# EAGLE design Arduino Uno Satyajeet (EAGLE 9.6.2)
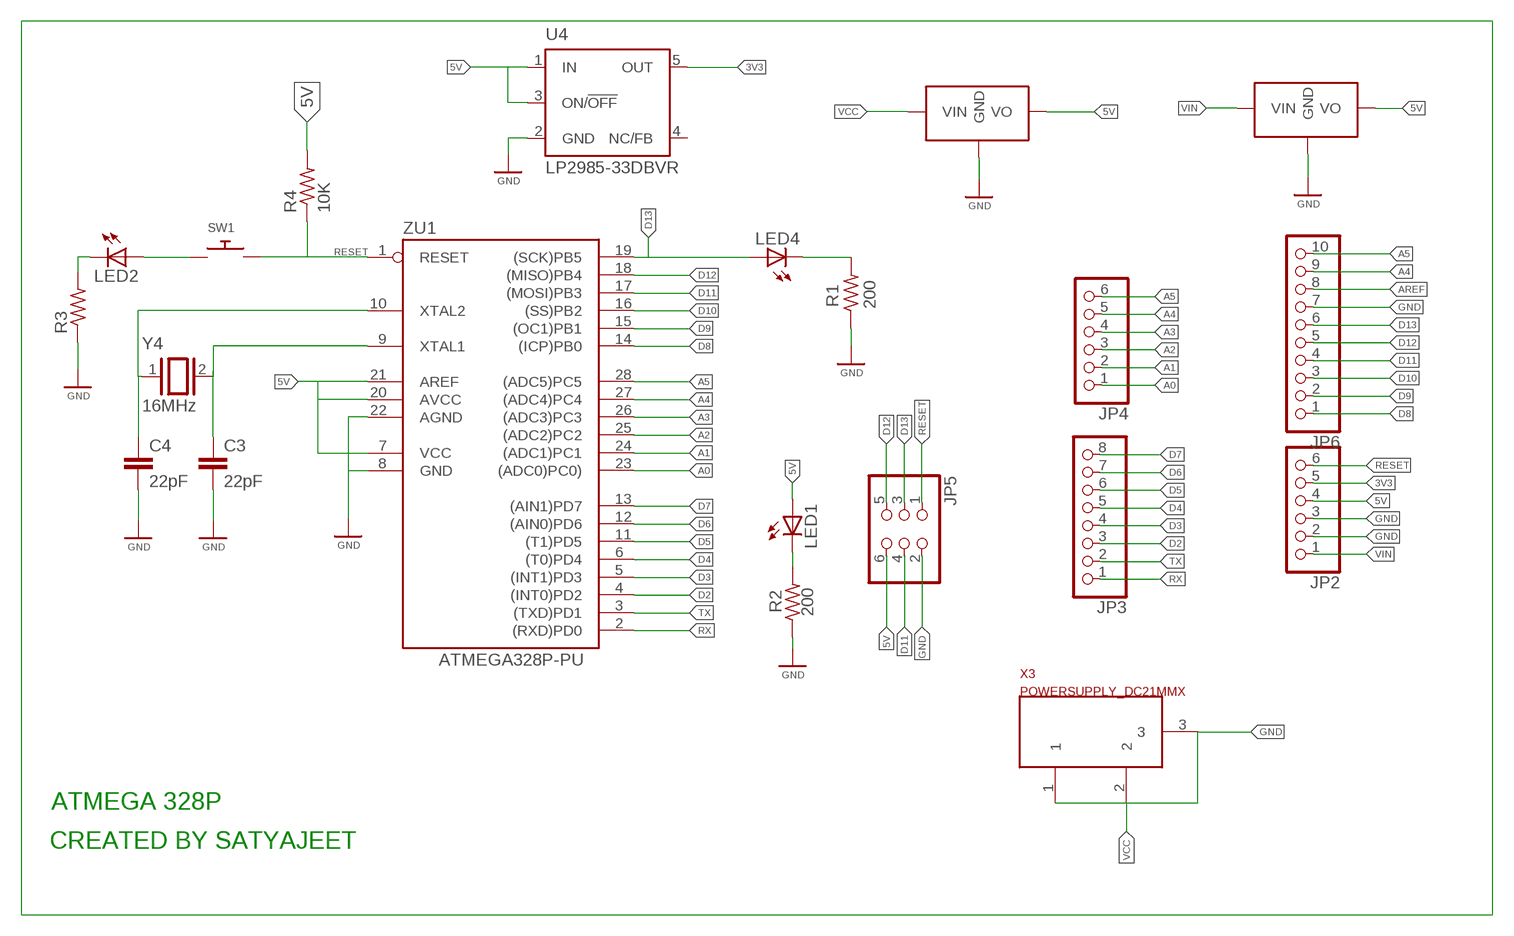
[diagram p0: schematic, sheet 1]

## Parts
C3  22pF  C2.5/2  [C2.5-2]
C4  22pF  C2.5/2  [C2.5-2]
JP2  PINHD-1X6  [1X06]
JP3  PINHD-1X8  [1X08]
JP4  PINHD-1X6  [1X06]
JP5  PINHD-2X3  [2X03]
JP6  PINHD-1X10  [1X10]
LED1  LED5MM  [LED5MM]
LED2  LED5MM  [LED5MM]
LED4  LED5MM  [LED5MM]
R1  200  R-US_0204/5  [0204/5]
R2  200  R-US_0204/5  [0204/5]
R3  R-US_0204/5  [0204/5]
R4  10K  R-US_0204/5  [0204/5]
SW1  SWITCH_PUSHBUTTONEVQ-PE  [TACT_PANA-EVQ]
U4  LP2985-33DBVR  LP2985-XXDBVR33  [SOT23-DBV]
U$1  AB_7805_FLAT  [AB_7805_FLAT]
U$2  AB_7805_FLAT  [AB_7805_FLAT]
X3  POWERSUPPLY_DC21MMX  [POWERSUPPLY_DC-21MM]
Y4  16MHz  XTAL/S  [QS]
ZU1  ATMEGA328P-PU  [DIL28-3]

## Nets
3V3: JP2.5 U4.5(OUT)
5V: JP2.4 JP5.6 LED1.A R4.2 U4.1(IN) U$1.3(VO) U$2.3(VO) ZU1.21(AREF)
A0 [data]: JP4.1 ZU1.23((ADC0)PC0))
A1 [data]: JP4.2 ZU1.24((ADC1)PC1)
A2 [data]: JP4.3 ZU1.25((ADC2)PC2)
A3 [data]: JP4.4 ZU1.26((ADC3)PC3)
A4 [data]: JP4.5 JP6.9 ZU1.27((ADC4)PC4)
A5 [data]: JP4.6 JP6.10 ZU1.28((ADC5)PC5)
AREF: JP6.8
D2 [data]: JP3.3 ZU1.4((INT0)PD2)
D3 [data]: JP3.4 ZU1.5((INT1)PD3)
D4 [data]: JP3.5 ZU1.6((T0)PD4)
D5 [data]: JP3.6 ZU1.11((T1)PD5)
D6 [data]: JP3.7 ZU1.12((AIN0)PD6)
D7 [data]: JP3.8 ZU1.13((AIN1)PD7)
D8 [data]: JP6.1 ZU1.14((ICP)PB0)
D9 [data]: JP6.2 ZU1.15((OC1)PB1)
D10 [data]: JP6.3 ZU1.16((SS)PB2)
D11 [data]: JP5.4 JP6.4 ZU1.17((MOSI)PB3)
D12 [data]: JP5.5 JP6.5 ZU1.18((MISO)PB4)
D13 [data]: JP5.3 JP6.6 LED4.A ZU1.19((SCK)PB5)
GND: C3.2 C4.2 JP2.2 JP2.3 JP5.2 JP6.7 R1.1 R2.1 R3.1 U4.2(GND) U$1.2(GND) U$2.2(GND) X3.1 X3.3 ZU1.22(AGND)
N$1: U4.3(ON/!OFF)
N$2 [data]: R4.1
N$3 [data]: C3.1 Y4.2 ZU1.9(XTAL1)
N$4 [data]: C4.1 Y4.1 ZU1.10(XTAL2)
N$5 [data]: ZU1.8(GND)
N$6 [data]: LED2.A SW1.P$1
N$7 [data]: LED2.K(C) R3.2
N$8 [data]: ZU1.7(VCC)
N$9 [data]: ZU1.20(AVCC)
N$11 [data]: LED4.K(C) R1.2
N$12: LED1.K(C) R2.2
RESET [data]: JP2.6 JP5.1 SW1.P$2 ZU1.1(RESET)
RX [data]: JP3.1 ZU1.2((RXD)PD0)
TX [data]: JP3.2 ZU1.3((TXD)PD1)
VCC: U$1.1(VIN) X3.2
VIN: JP2.1 U$2.1(VIN)
Unconnected: U4.4(NC/FB)

## Notes on the sheet
- ATMEGA 328P
- CREATED BY SATYAJEET

## Library data of the parts
C3 C4 = capacitor-wima:C: CAPACITOR naming: grid - package width
JP2 JP4 = pinhead:PINHD-1X6: PIN HEADER
JP3 = pinhead:PINHD-1X8: PIN HEADER
JP5 = pinhead:PINHD-2X3: PIN HEADER
JP6 = pinhead:PINHD-1X10: PIN HEADER
LED1 LED2 LED4 = adafruit:LED: LED OSRAM: - CHIPLED LG R971, LG N971, LY N971, LG Q971, LY Q971, LO R971, LY R971 LH N974, LH R974 LS Q976, LO Q976, LY Q976 LO Q996 - Hyper CHIPLED LW Q18S LB Q993, LB Q99A, LB R99A - SideLED LS A670, LO A670, LY A670, LG A670, LP A670 LB A673, LV A673, LT A673, LW A673 LH A674 LY A675 LS A676, LA A676, LO A676, LY A676, LW A676 LS A679, LY A679, LG A679 - Hyper Micro SIDELED® LS Y876, LA Y876, LO Y876, LY Y876 LT Y87S - SmartLED LW L88C, LW L88S LB L89C, LB L89S, LG L890 LS L89K, LO L89K, LY L89K LS L896, LA L896, LO L896, LY L896 - TOPLED LS T670, LO T670, LY T670, LG T670, LP T670 LSG T670, LSP T670, LSY T670, LOP T670, LYG T670 LG T671, LOG T671, LSG T671 LB T673, LV T673, LT T673, LW T673 LH T674 LS T676, LA T676, LO T676, LY T676, LB T676, LH T676, LSB T676, LW T676 LB T67C, LV T67C, LT T67C, LS T67K, LO T67K, LY T67K, LW E67C LS E67B, LA E67B, LO E67B, LY E67B, LB E67C, LV E67C, LT E67C LW T67C LS T679, LY T679, LG T679 LS T770, LO T770, LY T770, LG T770, LP T770 LB T773, LV T773, LT T773, LW T773 LH T774 LS E675, LA E675, LY E675, LS T675 LS T776, LA T776, LO T776, LY T776, LB T776 LHGB T686 LT T68C, LB T68C - Hyper Mini TOPLED® LB M676 - Mini TOPLED Santana® LG M470 LS M47K, LO M47K, LY M47K Source: http://www.osram.convergy.de/
R1-R4 = adafruit:R-US_: RESISTOR, American symbol
SW1 = adafruit:SWITCH_PUSHBUTTON: Buttons SOFTTOUCHSMD_SJ - Soft touch temporary push button (Super Junk Akihabara) Compatible with SKPMANE010 [Mouser: 688-SKPMAN] C&K_KSS = Digikey: KSS221GLFS
U4 = SmartPrj:LP2985-XXDBVR: ULTRALOW-POWER 50-mA LOW-DROPOUT LINEAR REGULATORS 50-mA Low-Dropout Regulator Source: http://focus.ti.com/lit/ds/symlink/tps77001.pdf
U$1 U$2 = AB_7805_FLAT:AB_7805_FLAT
X3 = SmartPrj:POWERSUPPLY_DC21MM
Y4 = SmartPrj:XTAL/S: CRYSTAL
ZU1 = SmartPrj:ATMEGA328P-: MICROCONTROLLER 4 Kbytes FLASH 128 bytes SRAM 256 bytes EEPROM UART 6-channel 10 bit ADC

## Net classes
0 default: width 0.61 mm, clearance 0.254 mm
1 data: width 0.406 mm, clearance 0.254 mm

## Board
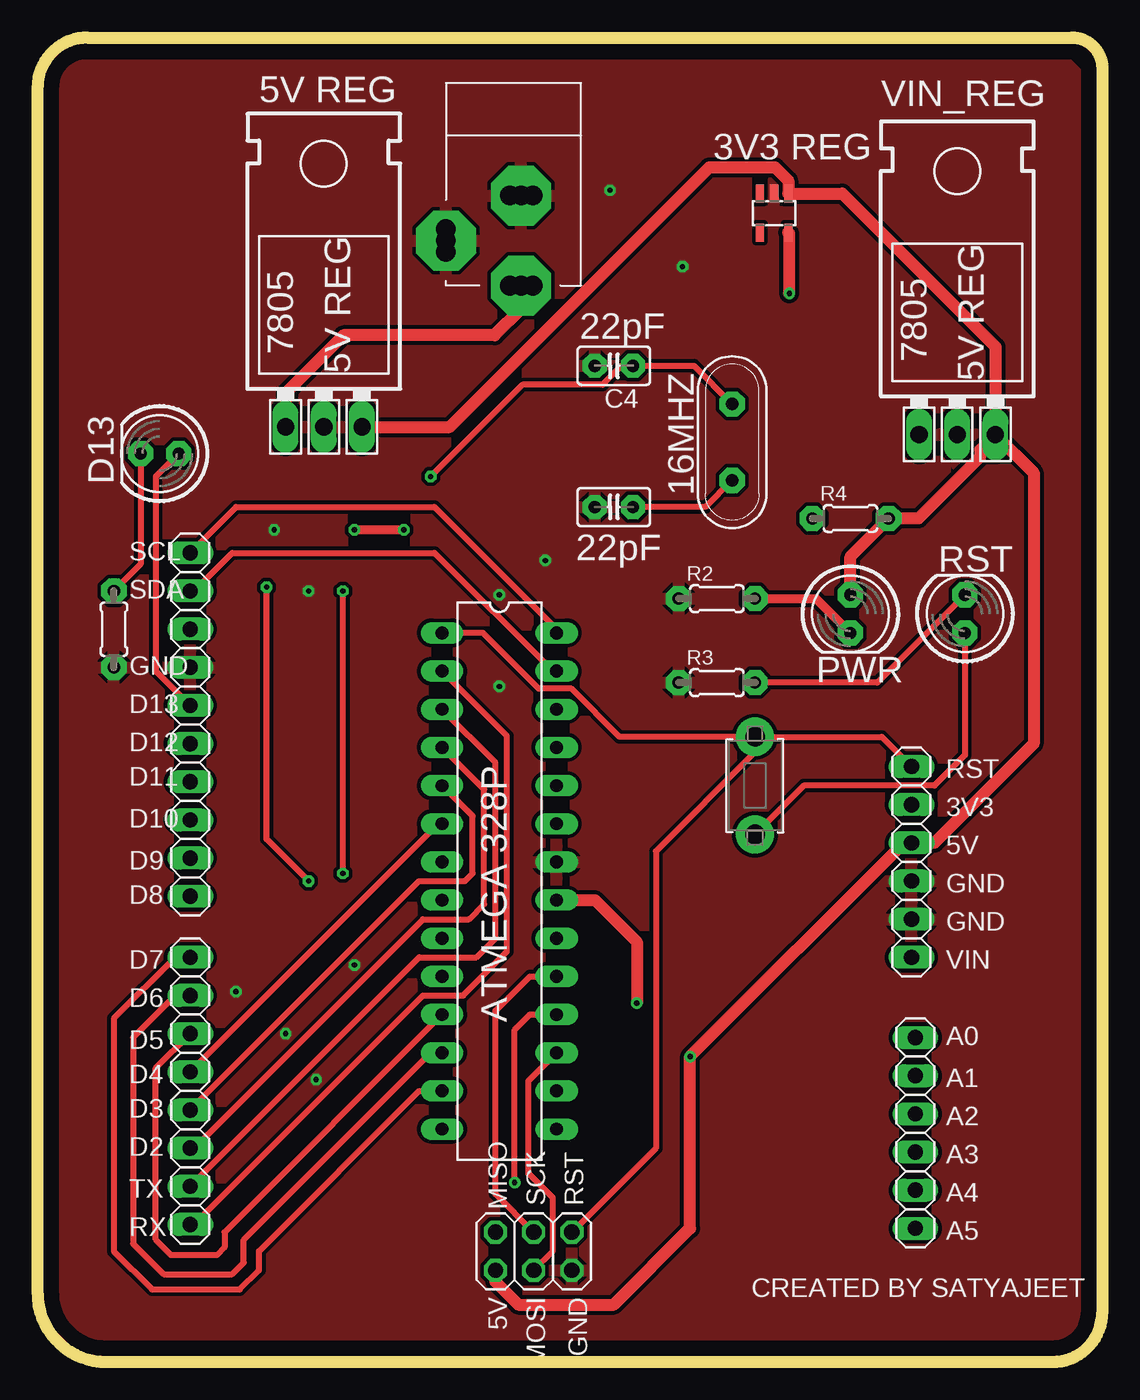
[diagram p1: board, top side]
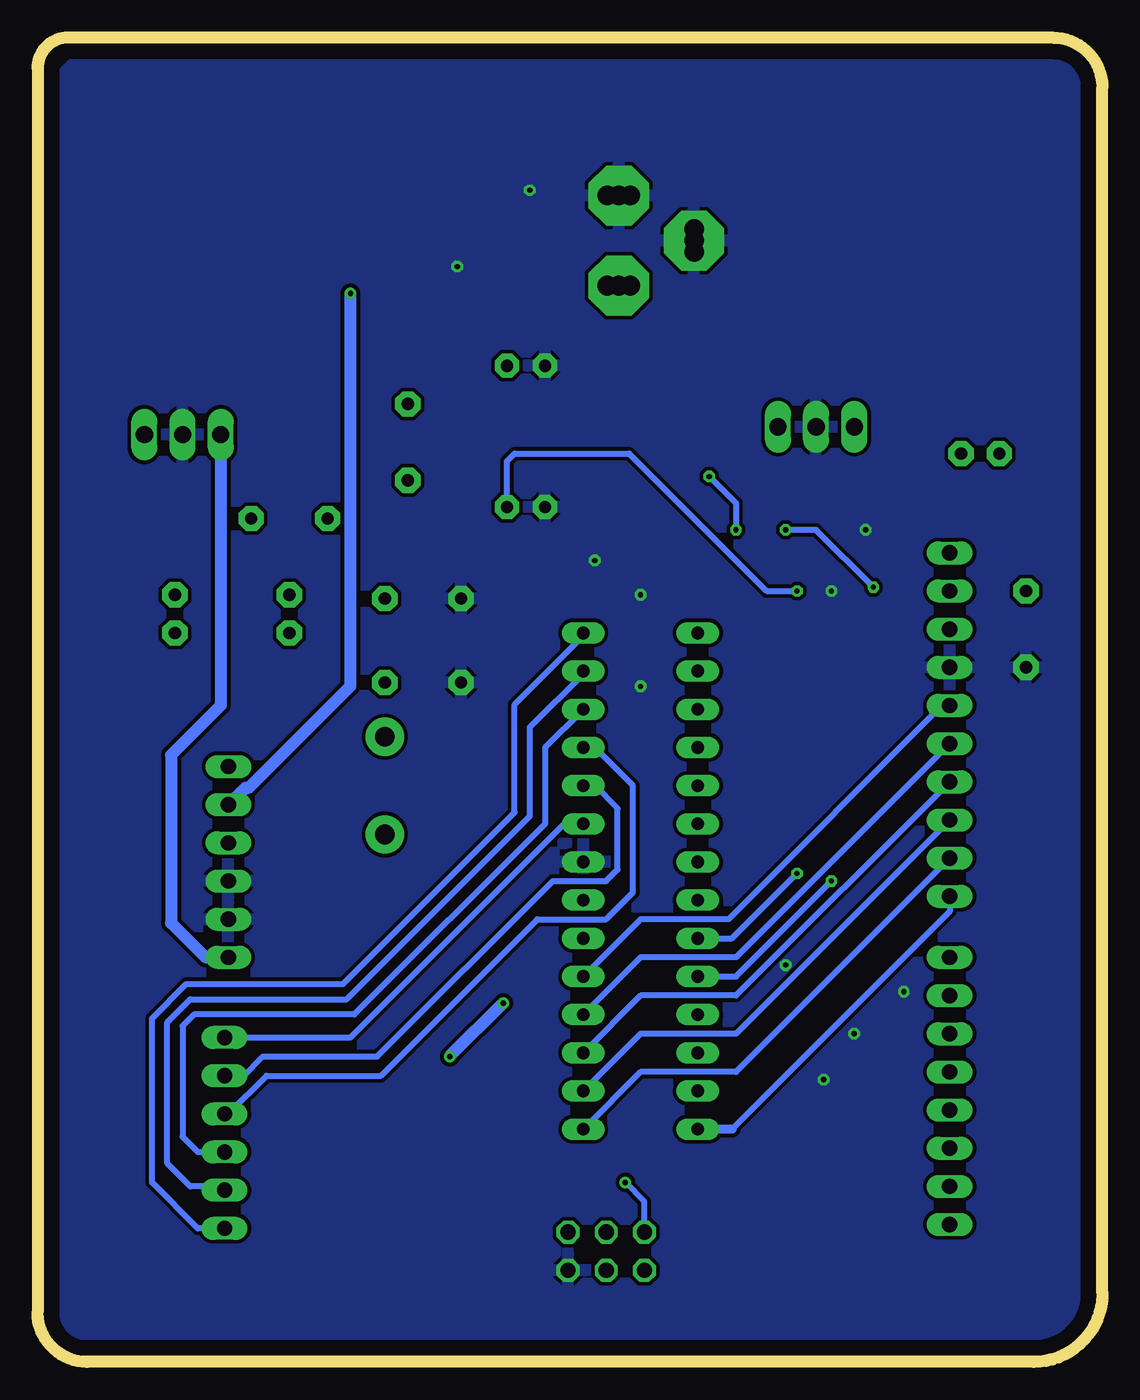
[diagram p2: board, bottom side, seen from below]

Size 70.87 x 88.14 mm. Coordinates in mm from the lower left corner, seen from the top.
Outline: 3.3,88.14 68.83,88.14 arc-90 70.87,86.11 70.87,3.3 arc-90 67.56,0 4.57,0 arc-90 0,4.57 0,84.84 arc-90 3.3,88.14
Copper layers (1*16): Top 0.035mm / dielectric 1.5mm / Bottom 0.035mm
Design rules "default *": minimum track width 10mil, minimum drill 0.35mm, track to track 10mil, track to pad 10mil, pad to pad 10mil, via to via 10mil, smd to smd 10mil, copper to edge 40mil, drill to drill 6mil, minimum pad ring 10mil, minimum via ring 8mil, stop-mask expansion 4mil, vias tented up to drill 0mil, thermal gap 10mil

### Footprints (pad centres in the part's own frame; a part is rotated, then mirrored left to right if it is on the bottom)
C2.5-2 = drill 0.813 pad 1.6 octagon: 1 -1.27,0; 2 1.27,0
1X06 = drill 1.016 long: 1 -6.35,0; 2 -3.81,0; 3 -1.27,0; 4 1.27,0; 5 3.81,0; 6 6.35,0
1X08 = drill 1.016 long: 1 -8.89,0; 2 -6.35,0; 3 -3.81,0; 4 -1.27,0; 5 1.27,0; 6 3.81,0; 7 6.35,0; 8 8.89,0
2X03 = drill 1.016 octagon: 1 -2.54,-1.27; 2 -2.54,1.27; 3 0,-1.27; 4 0,1.27; 5 2.54,-1.27; 6 2.54,1.27
1X10 = drill 1.016 long: 1 -11.43,0; 2 -8.89,0; 3 -6.35,0; 4 -3.81,0; 5 -1.27,0; 6 1.27,0; 7 3.81,0; 8 6.35,0; 9 8.89,0; 10 11.43,0
LED5MM = drill 0.813 pad 1.676 octagon: A -1.27,0; K 1.27,0
0204/5 = drill 0.813 pad 1.676 octagon: 1 -2.54,0; 2 2.54,0
TACT_PANA-EVQ = drill 1.3 pad 2.54: P$1 -3.25,0; P$2 3.25,0
SOT23-DBV = smd 0.55 x 1.2: 1 -0.95,-1.3; 2 0,-1.3; 3 0.95,-1.3; 4 0.95,1.3; 5 -0.95,1.3
AB_7805_FLAT = drill 1.143 long: 1 -7.874,1.778; 2 -7.874,-0.762; 3 -7.874,-3.302
POWERSUPPLY_DC-21MM = drill 1.3 pad 4 octagon: 1 -5.08,-3.353; 2 -0.076,-6.35; 3 -0.076,-0.356 | drill 1.3: 4 -5.08,-4.115; 5 -5.08,-2.591; 6 -0.838,-0.356; 7 0.686,-0.356; 8 -0.838,-6.35; 9 0.686,-6.35
QS = drill 0.85 pad 1.676 octagon: 1 -2.54,0; 2 2.54,0
DIL28-3 = drill 0.85 pad 1.422 long: 1 -16.51,-3.81; 2 -13.97,-3.81; 3 -11.43,-3.81; 4 -8.89,-3.81; 5 -6.35,-3.81; 6 -3.81,-3.81; 7 -1.27,-3.81; 8 1.27,-3.81; 9 3.81,-3.81; 10 6.35,-3.81; 11 8.89,-3.81; 12 11.43,-3.81; 13 13.97,-3.81; 14 16.51,-3.81; 15 16.51,3.81; 16 13.97,3.81; 17 11.43,3.81; 18 8.89,3.81; 19 6.35,3.81; 20 3.81,3.81; 21 1.27,3.81; 22 -1.27,3.81; 23 -3.81,3.81; 24 -6.35,3.81; 25 -8.89,3.81; 26 -11.43,3.81; 27 -13.97,3.81; 28 -16.51,3.81

### Placement (x,y rotation side)
C3  38.35,56.9 180 top
C4  38.35,66.29 180 top
JP2  58.17,33.27 90 top
JP3  10.16,18.03 90 top
JP4  58.42,15.24 270 top
JP5  33.02,7.37 180 top
JP6  10.16,42.42 90 top
LED1  54.1,49.78 270 top
LED2  61.72,49.78 90 top
LED4  8.13,60.45 180 top
R1  5.08,48.77 90 top
R2  45.21,50.8 0 top
R3  45.21,45.21 0 top
R4  54.1,56.13 0 top
SW1  47.75,38.35 90 top
U4  49.02,76.45 180 top
U$1  18.29,70.1 90 top
U$2  60.45,69.6 90 top
X3  32.26,77.98 0 top
Y4  46.23,61.21 270 top
ZU1  30.73,32 270 top

### Tracks (layer width: path | path; a pad name or v marks a point on that pad's centre or on a via)
3V3  (via drill 0.35)
  Top 0.813: v50.04,71.12 50.04,75.09 U4.5
  Bottom 0.813: JP2.5 57.05,38.2 56.82,38.2 50.04,44.98 v50.04,71.12
5V  (via drill 0.35)
  Top 0.813: U$2.3 62.73,60.7 62.73,60.24 58.63,56.13 R4.2 54.1,53.59 LED1.A | ZU1.21 37.08,30.73 39.88,27.94 v39.88,23.88 | JP5.6 30.48,5.33 32,3.81 38.35,3.81 43.43,8.89 v43.43,20.32 57.66,34.54 JP2.4 59.69,34.54 66.29,41.15 66.29,59.18 U$2.3 | U$2.3 63.75,67.56 53.56,77.75 U4.1 49.96,77.77 49.96,78.63 49.08,79.5 44.7,79.5 27.43,62.23 U$1.3
  Bottom 0.813: v39.88,23.88 v43.43,20.32
A0
  Bottom 0.406: JP4.1 50.04,21.59 35.81,35.81 ZU1.23
A1
  Bottom 0.406: JP4.2 57.15,19.05 55.88,20.32 48.26,20.32 36.58,32 33.02,32 32.26,32.77 32.26,36.83 33.78,38.35 ZU1.24
A2
  Bottom 0.406: 58.17,16.51 55.63,19.05 48.01,19.05 37.59,29.46 33.02,29.46 31.24,31.24 31.24,38.35 33.78,40.89 ZU1.25
  Bottom 0.61: JP4.3 58.17,16.51
A3
  Bottom 0.406: ZU1.26 37.08,40.89 37.08,35.81 49.78,23.11 60.45,23.11 61.21,22.35 61.21,14.99 60.2,13.97 JP4.4
A4
  Top 0.406: JP6.9 10.41,51.31 12.95,53.85 26.42,53.85 34.29,45.97 ZU1.27
  Bottom 0.406: 58.67,11.68 60.71,11.68 62.23,13.21 62.23,22.61 60.71,24.13 50.29,24.13 38.1,36.32 38.1,42.24 34.54,45.8
  Bottom 0.61: JP4.5 58.67,11.68 | 34.54,45.8 ZU1.27
A5
  Top 0.406: JP6.10 13.21,56.9 26.42,56.9 34.54,48.77 ZU1.28
  Bottom 0.406: JP4.6 60.2,8.89 63.25,11.94 63.25,22.86 60.96,25.15 50.55,25.15 39.12,36.58 39.12,43.77 34.54,48.34
  Bottom 0.61: 34.54,48.34 ZU1.28
D2
  Top 0.406: JP3.3 10.41,14.22 25.65,29.46 28.7,29.46 29.72,30.48 29.72,38.1 ZU1.4
D3
  Top 0.406: JP3.4 25.4,32 28.45,32 28.96,32.51 28.96,36.32 ZU1.5
D4
  Top 0.406: ZU1.6 26.67,35.81 JP3.5
D5
  Top 0.406: JP3.6 7.87,19.56 7.87,8.13 8.89,7.11 11.94,7.11 12.45,7.62 12.45,8.64 ZU1.11
D6
  Top 0.406: ZU1.12 26.16,20.57 13.72,8.13 13.72,6.6 12.95,5.84 8.38,5.84 6.35,7.87 6.35,21.59 9.14,24.38
  Top 0.61: JP3.7 9.14,24.38
D7
  Top 0.406: 9.14,26.92 5.08,22.86 5.08,7.37 7.62,4.83 13.46,4.83 14.73,6.1 14.73,7.37 25.4,18.03 ZU1.13
  Top 0.61: JP3.8 9.14,26.92
D8
  Bottom 0.406: 24.64,15.49 10.16,29.97 JP6.1
  Bottom 0.61: 24.64,15.49 ZU1.14
D9
  Bottom 0.406: JP6.2 24.38,19.3 30.73,19.3 ZU1.15
D10
  Bottom 0.406: JP6.3 24.38,21.84 30.73,21.84 ZU1.16
D11
  Top 0.406: JP5.4 34.29,7.37 34.29,10.92 32.66,12.55 32.66,18.69 ZU1.17
  Bottom 0.406: JP6.4 24.38,24.38 30.73,24.38 ZU1.17
D12  (via drill 0.35)
  Top 0.406: v31.75,11.94 31.75,22.1 32.77,23.11 ZU1.18
  Bottom 0.406: JP6.5 24.38,26.92 30.73,26.92 ZU1.18 | JP5.5 30.48,10.67 v31.75,11.94
D13
  Top 0.406: JP5.3 30.48,11.18 30.48,23.37 32.77,25.65 ZU1.19 | LED4.A 7.87,58.93 7.87,45.97 JP6.6
  Bottom 0.406: JP6.6 10.67,43.69 24.89,29.46 30.73,29.46 ZU1.19
GND  (via drill 0.35)
  other vias: 33.78,53.34 30.73,51.05 30.73,44.96 38.1,77.98 42.93,72.9 15.75,55.37 18.03,51.31 13.21,24.64 18.54,18.8 16.51,21.84 21.08,26.42
  pour Top: 67.56,87.38 3.3,87.38 0.76,84.84 0.76,4.06 4.06,0.76 67.56,0.76 70.1,3.3 70.1,84.84
  pour Bottom: 67.56,87.38 3.3,87.38 0.76,84.84 0.76,4.06 4.06,0.76 67.56,0.76 70.1,3.3 70.1,84.84
N$3  (via drill 0.35)
  Top 0.406: Y4.2 44.45,56.9 C3.1 | v20.32,32.51 v20.32,51.31
  Bottom 0.406: ZU1.9 24.64,28.19 v20.32,32.51 | C3.1 39.62,59.94 39.12,60.45 31.5,60.45 22.35,51.31 v20.32,51.31
N$4  (via drill 0.35)
  Top 0.406: Y4.1 43.69,66.29 C4.1 38.86,66.29 37.61,65.04 32.27,65.04 v26.16,58.93 | v18.03,32 15.24,34.8 v15.24,51.56
  Top 0.61: v24.38,55.37 v21.08,55.37
  Bottom 0.406: v26.16,58.93 24.38,57.15 v24.38,55.37 | ZU1.10 24.38,25.65 v18.03,32 | v15.24,51.56 19.05,55.37 v21.08,55.37
N$6
  Top 0.406: LED2.A 61.72,40.39 59.69,38.35 51,38.35 SW1.P$1
N$7
  Top 0.406: LED2.K 55.88,45.21 R3.2
N$11
  Top 0.406: LED4.K 6.86,53.09 R1.2
N$12
  Top 0.61: R2.2 51.82,50.8 LED1.K
RESET
  Top 0.406: SW1.P$2 56.19,41.6 JP2.6 | SW1.P$2 38.74,41.6 35.54,44.81 33.35,44.81 29.64,48.51 ZU1.1 | JP5.1 41.15,14.22 41.15,33.98 47.75,40.59 SW1.P$2
RX
  Top 0.406: ZU1.2 31.24,41.66 31.24,27.3 28.32,24.38 25.65,24.38 10.41,9.14 JP3.1
TX
  Top 0.406: JP3.2 25.4,26.92 29.21,26.92 30.48,28.19 30.48,39.88 ZU1.3
VCC
  Top 0.813: U$1.1 16.52,64.48 20.36,68.33 30.43,68.33 32.18,70.08 X3.2
VIN
  Bottom 0.813: U$2.1 58.67,43.69 61.98,40.39 61.98,29.21 59.69,26.92 JP2.1

### Text on the board
tNames: 5V REG | VIN_REG | 3V3 REG | 22pF | D13 | 16MHZ | SCL | 22pF | RST | SDA | GND | PWR | D13 | D12 | D11 | RST | 3V3 | D10 | 5V | D9 | GND | D8 | GND | D7 | VIN | D6 | ATMEGA 328P | D5 | A0 | D4 | A1 | D3 | A2 | D2 | A3 | TX | SCK | RST | A4 | MISO | RX | A5 | 5V | MOSI | GND | CREATED BY SATYAJEET